# EAGLE design seniorprj1 (EAGLE 9.6.2)
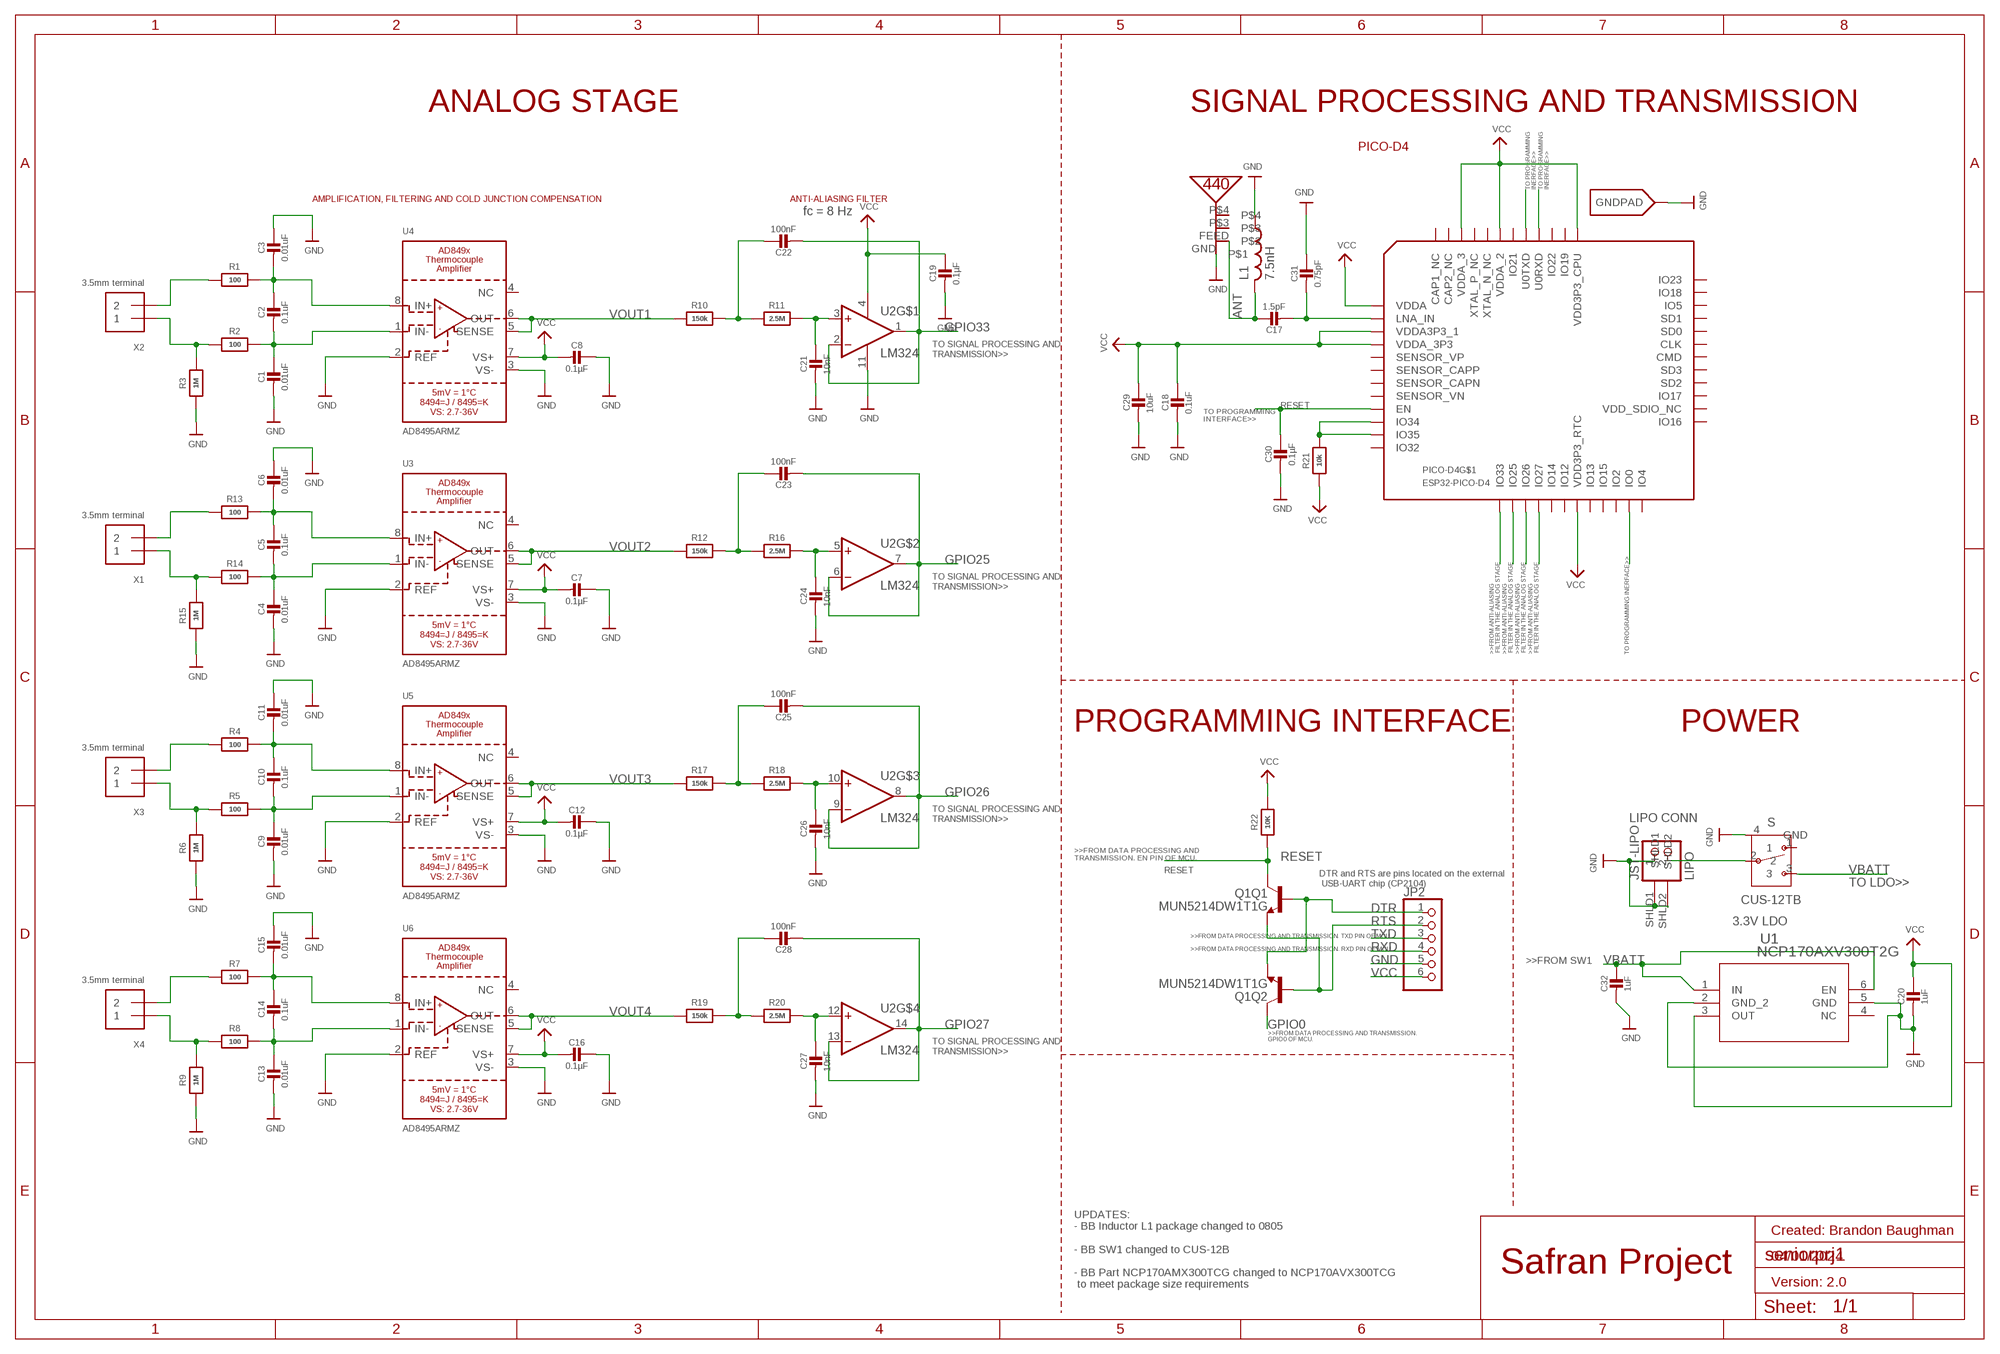
[diagram p0: schematic, sheet 1]

## Parts
C1  0.01uF  CAP_CERAMIC0805-NOOUTLINE  [0805-NO@1]
C2  0.1uF  CAP_CERAMIC0805-NOOUTLINE  [0805-NO@1]
C3  0.01uF  CAP_CERAMIC0805-NOOUTLINE  [0805-NO@1]
C4  0.01uF  CAP_CERAMIC0805-NOOUTLINE  [0805-NO@1]
C5  0.1uF  CAP_CERAMIC0805-NOOUTLINE  [0805-NO@1]
C6  0.01uF  CAP_CERAMIC0805-NOOUTLINE  [0805-NO@1]
C7  0.1µF  CAP_CERAMIC0805-NOOUTLINE  [0805-NO@1]
C8  0.1µF  CAP_CERAMIC0805-NOOUTLINE  [0805-NO@1]
C9  0.01uF  CAP_CERAMIC0805-NOOUTLINE  [0805-NO@1]
C10  0.1uF  CAP_CERAMIC0805-NOOUTLINE  [0805-NO@1]
C11  0.01uF  CAP_CERAMIC0805-NOOUTLINE  [0805-NO@1]
C12  0.1µF  CAP_CERAMIC0805-NOOUTLINE  [0805-NO@1]
C13  0.01uF  CAP_CERAMIC0805-NOOUTLINE  [0805-NO@1]
C14  0.1uF  CAP_CERAMIC0805-NOOUTLINE  [0805-NO@1]
C15  0.01uF  CAP_CERAMIC0805-NOOUTLINE  [0805-NO@1]
C16  0.1µF  CAP_CERAMIC0805-NOOUTLINE  [0805-NO@1]
C17  1.5pF  CAP_CERAMIC0805-NOOUTLINE  [0805-NO@1]
C18  0.1uF  CAP_CERAMIC0805-NOOUTLINE  [0805-NO@1]
C19  0.1µF  CAP_CERAMIC0805-NOOUTLINE  [0805-NO@1]
C20  1uF  CAP_CERAMIC0805-NOOUTLINE  [0805-NO@1]
C21  10nF  CAP_CERAMIC0805-NOOUTLINE  [0805-NO@1]
C22  100nF  CAP_CERAMIC0805-NOOUTLINE  [0805-NO@1]
C23  100nF  CAP_CERAMIC0805-NOOUTLINE  [0805-NO@1]
C24  10nF  CAP_CERAMIC0805-NOOUTLINE  [0805-NO@1]
C25  100nF  CAP_CERAMIC0805-NOOUTLINE  [0805-NO@1]
C26  10nF  CAP_CERAMIC0805-NOOUTLINE  [0805-NO@1]
C27  10nF  CAP_CERAMIC0805-NOOUTLINE  [0805-NO@1]
C28  100nF  CAP_CERAMIC0805-NOOUTLINE  [0805-NO@1]
C29  10uF  CAP_CERAMIC0805-NOOUTLINE  [0805-NO@1]
C30  0.1µF  CAP_CERAMIC0805-NOOUTLINE  [0805-NO@1]
C31  0.75pF  CAP_CERAMIC0805-NOOUTLINE  [0805-NO@1]
C32  1uF  CAP_CERAMIC0805-NOOUTLINE  [0805-NO@1]
JP2  PINHD-1X6  [1X06]
JST-LIPO  LIPO  JST_2PIN  [JSTPH2]
L1  7.5nH  INDUCTOR_0805_N  [RESC0805_N]
PICO-D4  ESP32-PICO-D4  [PICO-D4-QFN48]
Q1  MUN5214DW1T1G  MBT3904DW1T1  [DUAL_NPN_SC70-6]
R1  100  RESISTOR0805_NOOUTLINE  [0805-NO]
R2  100  RESISTOR0805_NOOUTLINE  [0805-NO]
R3  1M  RESISTOR0805_NOOUTLINE  [0805-NO]
R4  100  RESISTOR0805_NOOUTLINE  [0805-NO]
R5  100  RESISTOR0805_NOOUTLINE  [0805-NO]
R6  1M  RESISTOR0805_NOOUTLINE  [0805-NO]
R7  100  RESISTOR0805_NOOUTLINE  [0805-NO]
R8  100  RESISTOR0805_NOOUTLINE  [0805-NO]
R9  1M  RESISTOR0805_NOOUTLINE  [0805-NO]
R10  150k  RESISTOR0805_NOOUTLINE  [0805-NO]
R11  2.5M  RESISTOR0805_NOOUTLINE  [0805-NO]
R12  150k  RESISTOR0805_NOOUTLINE  [0805-NO]
R13  100  RESISTOR0805_NOOUTLINE  [0805-NO]
R14  100  RESISTOR0805_NOOUTLINE  [0805-NO]
R15  1M  RESISTOR0805_NOOUTLINE  [0805-NO]
R16  2.5M  RESISTOR0805_NOOUTLINE  [0805-NO]
R17  150k  RESISTOR0805_NOOUTLINE  [0805-NO]
R18  2.5M  RESISTOR0805_NOOUTLINE  [0805-NO]
R19  150k  RESISTOR0805_NOOUTLINE  [0805-NO]
R20  2.5M  RESISTOR0805_NOOUTLINE  [0805-NO]
R21  10k  RESISTOR0805_NOOUTLINE  [0805-NO]
R22  10K  RESISTOR0805_NOOUTLINE  [0805-NO]
S  CUS-12TB  [CUS-12B]
U1  NCP170AXV300T2G  [SOT-563_1P3X1P7_ONS]
U2  LM324  [SOIC127P600X175-14N]
U3  AD8495ARMZ  AD849X  [MSOP8_0.65MM]
U4  AD8495ARMZ  AD849X  [MSOP8_0.65MM]
U5  AD8495ARMZ  AD849X  [MSOP8_0.65MM]
U6  AD8495ARMZ  AD849X  [MSOP8_0.65MM]
U$35  PRO-OB-440  [PRO-OB-440]
X1  3.5mm terminal  TERMBLOCK_1X2  [TERMBLOCK_1X2-3.5MM]
X2  3.5mm terminal  TERMBLOCK_1X2  [TERMBLOCK_1X2-3.5MM]
X3  3.5mm terminal  TERMBLOCK_1X2  [TERMBLOCK_1X2-3.5MM]
X4  3.5mm terminal  TERMBLOCK_1X2  [TERMBLOCK_1X2-3.5MM]

## Nets
ANT: C17.1 L1.2 U$35.FEED
DTR: JP2.1 Q1.1(Q2:E) Q1.5(Q1:B)
GND: C1.2 C3.1 C4.2 C6.1 C7.1 C8.1 C9.2 C11.1 C12.1 C13.2 C15.1 C16.1 C18.2 C19.2 C20.2 C21.2 C24.2 C26.2 C27.2 C29.2 C30.2 C31.1 C32.2 JP2.5 JST-LIPO.1 JST-LIPO.SHLD1 JST-LIPO.SHLD2 L1.1 PICO-D4.EXP(GNDPAD) R3.1 R6.1 R9.1 R15.1 S.4(GND) U1.2(GND_2) U1.5(GND) U2.11(VCC-) U3.2(REF) U3.3(VS-) U4.2(REF) U4.3(VS-) U5.2(REF) U5.3(VS-) U6.2(REF) U6.3(VS-) U$35.GND
GPIO0: PICO-D4.23(IO0) Q1.6(Q2:C)
GPIO25: C23.2 U2.6(INVERTING_INPUT2) U2.7(OUTPUT2)
GPIO26: C25.2 U2.8(OUTPUT3) U2.9(INVERTING_INPUT3)
GPIO27: C28.2 U2.13(INVERTING_INPUT4) U2.14(OUTPUT4)
GPIO33: C22.2 U2.1(OUTPUT1) U2.2(INVERTING_INPUT1)
IN+: R13.1 X1.2
IN+1: R1.1 X2.2
IN+2: R4.1 X3.2
IN+3: R7.1 X4.2
IN-: R14.1 R15.2 X1.1
IN-1: R2.1 R3.2 X2.1
IN-2: R5.1 R6.2 X3.1
IN-3: R8.1 R9.2 X4.1
LNA_IN: C17.2 C31.2 PICO-D4.2(LNA_IN)
N$1: C2.1 C3.2 R1.2 U4.8(IN+)
N$2: C5.1 C6.2 R13.2 U3.8(IN+)
N$3: C4.1 C5.2 R14.2
N$4: U3.1(IN-)
N$5: C1.1 C2.2 R2.2 U4.1(IN-)
N$7: C10.1 C11.2 R4.2 U5.8(IN+)
N$8: C9.1 C10.2 R5.2
N$9: U5.1(IN-)
N$10: C14.1 C15.2 R7.2 U6.8(IN+)
N$11: C13.1 C14.2 R8.2
N$12: U6.1(IN-)
N$13: JST-LIPO.2 S.2
N$14: C22.1 R10.2 R11.1
N$15: PICO-D4.13(IO33)
N$16: C21.1 R11.2 U2.3(NON-INVERTING_INPUT1)
N$17: C24.1 R16.2 U2.5(NON-INVERTING_INPUT2)
N$18: C23.1 R12.2 R16.1
N$19: PICO-D4.14(IO25)
N$20: C25.1 R17.2 R18.1
N$21: C28.1 R19.2 R20.1
N$22: C26.1 R18.2 U2.10(NON-INVERTING_INPUT3)
N$23: C27.1 R20.2 U2.12(NON-INVERTING_INPUT4)
N$24: PICO-D4.15(IO26)
N$25: PICO-D4.16(IO27)
N$26: PICO-D4.10(IO34) PICO-D4.11(IO35) R21.2
RESET: C30.1 PICO-D4.9(EN) Q1.3(Q1:C) R22.1
RTS: JP2.2 Q1.2(Q2:B) Q1.4(Q1:E)
RXD: JP2.4 PICO-D4.40(U0RXD)
TXD: JP2.3 PICO-D4.41(U0TXD)
VBATT: C32.1 S.3 U1.1(IN) U1.6(EN)
VCC: C7.2 C8.2 C12.2 C16.2 C18.1 C19.1 C20.1 C29.1 JP2.6 PICO-D4.1(VDDA) PICO-D4.3(VDDA3P3_1) PICO-D4.4(VDDA_3P3) PICO-D4.19(VDD3P3_RTC) PICO-D4.37(VDD3P3_CPU) PICO-D4.43(VDDA_2) PICO-D4.46(VDDA_3) R21.1 R22.2 U1.3(OUT) U2.4(VCC+) U3.7(VS+) U4.7(VS+) U5.7(VS+) U6.7(VS+)
VOUT1: R10.1 U4.5(SENSE) U4.6(OUT)
VOUT2: R12.1 U3.5(SENSE) U3.6(OUT)
VOUT3: R17.1 U5.5(SENSE) U5.6(OUT)
VOUT4: R19.1 U6.5(SENSE) U6.6(OUT)
Unconnected: PICO-D4.5(SENSOR_VP) PICO-D4.6(SENSOR_CAPP) PICO-D4.8(SENSOR_VN) PICO-D4.12(IO32) PICO-D4.17(IO14) PICO-D4.20(IO13) PICO-D4.21(IO15) PICO-D4.22(IO2) PICO-D4.24(IO4) PICO-D4.25(IO16) PICO-D4.26(VDD_SDIO_NC) PICO-D4.27(IO17) PICO-D4.28(SD2) PICO-D4.29(SD3) PICO-D4.30(CMD) PICO-D4.31(CLK) PICO-D4.32(SD0) PICO-D4.33(SD1) PICO-D4.34(IO5) PICO-D4.35(IO18) PICO-D4.36(IO23) PICO-D4.38(IO19) PICO-D4.39(IO22) PICO-D4.44(XTAL_N_NC) PICO-D4.45(XTAL_P_NC) PICO-D4.47(CAP2_NC) PICO-D4.48(CAP1_NC) S.1 U1.4(NC) U3.4(NC) U4.4(NC) U5.4(NC) U6.4(NC) U$35.P$3 U$35.P$4

## Notes on the sheet
- ANALOG STAGE | SIGNAL PROCESSING AND TRANSMISSION
- PICO-D4
- TO PROGRAMMING
  INERFACE>>
- TO PROGRAMMING
  INERFACE>>
- AMPLIFICATION, FILTERING AND COLD JUNCTION COMPENSATION | ANTI-ALIASING FILTER
- fc = 8 Hz
- TO SIGNAL PROCESSING AND 
  TRANSMISSION>>
- TO PROGRAMMING 
  INTERFACE>>
- TO SIGNAL PROCESSING AND 
  TRANSMISSION>>
- >>FROM ANTI-ALIASING
   FILTER IN THE ANALOG STAGE
- >>FROM ANTI-ALIASING
   FILTER IN THE ANALOG STAGE
- >>FROM ANTI-ALIASING
   FILTER IN THE ANALOG STAGE
- >>FROM ANTI-ALIASING
   FILTER IN THE ANALOG STAGE
- TO PROGRAMMING INERFACE>>
- PROGRAMMING INTERFACE | POWER
- TO SIGNAL PROCESSING AND 
  TRANSMISSION>>
- LIPO CONN
- >>FROM DATA PROCESSING AND
  TRANSMISSION. EN PIN OF MCU.
- DTR and RTS are pins located on the external
   USB-UART chip (CP2104)
- TO LDO>>
- 3.3V LDO
- >>FROM DATA PROCESSING AND TRANSMISSION. TXD PIN OF MCU.
- >>FROM DATA PROCESSING AND TRANSMISSION. RXD PIN OF MCU.
- >>FROM SW1
- >>FROM DATA PROCESSING AND TRANSMISSION. 
  GPIO0 OF MCU.
- TO SIGNAL PROCESSING AND 
  TRANSMISSION>>
- NCP167BMX330TBG
- NCP167BMX330TBG
- Created: Brandon Baughman
- 04/01/2024
- Safran Project
- Version: 2.0
- UPDATES:
  - BB Inductor L1 package changed to 0805
  
  - BB SW1 changed to CUS-12B
  
  - BB Part NCP170AMX300TCG changed to NCP170AVX300TCG
   to meet package size requirements

## Power pins joined to a net without a drawn wire
IO12: PICO-D4.18(IO12)
IO21: PICO-D4.42(IO21)
SENSOR_CAPN: PICO-D4.7(SENSOR_CAPN)

## Library data of the parts
C1 C3 C4 C6 C9 C11 C13 C15 = microbuilder:CAP_CERAMIC: Ceramic Capacitors For new designs, use the packages preceded by an '_' character since they are more reliable: The following footprints should be used on most boards: _0402 - Standard footprint for regular board layouts _0603 - Standard footprint for regular board layouts _0805 - Standard footprint for regular board layouts _1206 - Standard footprint for regular board layouts For extremely tight-pitch boards where space is at a premium, the following 'micro-pitch' footprints can be used (smaller pads, no silkscreen outline, etc.): _0402MP - Micro-pitch footprint for very dense/compact boards _0603MP - Micro-pitch footprint for very dense/compact boards _0805MP - Micro-pitch footprint for very dense/compact boards _1206MP - Micro-pitch footprint for very dense/compact boards; MF: KEMET; MPN: R76PD2100SE30J; OC_NEWARK: 58Y5376
C2 C5 C7 C8 C10 C12 C14 C16 C18 C19 C22 C23 C25 C28 C30 = microbuilder:CAP_CERAMIC: Ceramic Capacitors For new designs, use the packages preceded by an '_' character since they are more reliable: The following footprints should be used on most boards: _0402 - Standard footprint for regular board layouts _0603 - Standard footprint for regular board layouts _0805 - Standard footprint for regular board layouts _1206 - Standard footprint for regular board layouts For extremely tight-pitch boards where space is at a premium, the following 'micro-pitch' footprints can be used (smaller pads, no silkscreen outline, etc.): _0402MP - Micro-pitch footprint for very dense/compact boards _0603MP - Micro-pitch footprint for very dense/compact boards _0805MP - Micro-pitch footprint for very dense/compact boards _1206MP - Micro-pitch footprint for very dense/compact boards; MF: KEMET; MPN: C0805C104K1RECTU; OC_NEWARK: 02AH1357
C17 = microbuilder:CAP_CERAMIC: Ceramic Capacitors For new designs, use the packages preceded by an '_' character since they are more reliable: The following footprints should be used on most boards: _0402 - Standard footprint for regular board layouts _0603 - Standard footprint for regular board layouts _0805 - Standard footprint for regular board layouts _1206 - Standard footprint for regular board layouts For extremely tight-pitch boards where space is at a premium, the following 'micro-pitch' footprints can be used (smaller pads, no silkscreen outline, etc.): _0402MP - Micro-pitch footprint for very dense/compact boards _0603MP - Micro-pitch footprint for very dense/compact boards _0805MP - Micro-pitch footprint for very dense/compact boards _1206MP - Micro-pitch footprint for very dense/compact boards; MF: YAGEO; MPN: CC0805CRNPO9BN1R5; OC_NEWARK: 26AK1928
C20 C32 = microbuilder:CAP_CERAMIC: Ceramic Capacitors For new designs, use the packages preceded by an '_' character since they are more reliable: The following footprints should be used on most boards: _0402 - Standard footprint for regular board layouts _0603 - Standard footprint for regular board layouts _0805 - Standard footprint for regular board layouts _1206 - Standard footprint for regular board layouts For extremely tight-pitch boards where space is at a premium, the following 'micro-pitch' footprints can be used (smaller pads, no silkscreen outline, etc.): _0402MP - Micro-pitch footprint for very dense/compact boards _0603MP - Micro-pitch footprint for very dense/compact boards _0805MP - Micro-pitch footprint for very dense/compact boards _1206MP - Micro-pitch footprint for very dense/compact boards; MF: KYOCERA AVX; MPN: 08051C105K4T2A; OC_NEWARK: 47AC9927
C21 C24 C26 C27 = microbuilder:CAP_CERAMIC: Ceramic Capacitors For new designs, use the packages preceded by an '_' character since they are more reliable: The following footprints should be used on most boards: _0402 - Standard footprint for regular board layouts _0603 - Standard footprint for regular board layouts _0805 - Standard footprint for regular board layouts _1206 - Standard footprint for regular board layouts For extremely tight-pitch boards where space is at a premium, the following 'micro-pitch' footprints can be used (smaller pads, no silkscreen outline, etc.): _0402MP - Micro-pitch footprint for very dense/compact boards _0603MP - Micro-pitch footprint for very dense/compact boards _0805MP - Micro-pitch footprint for very dense/compact boards _1206MP - Micro-pitch footprint for very dense/compact boards; MF: KEMET; MPN: C0805C103K1RECTU; OC_NEWARK: 02AH1349
C29 = microbuilder:CAP_CERAMIC: Ceramic Capacitors For new designs, use the packages preceded by an '_' character since they are more reliable: The following footprints should be used on most boards: _0402 - Standard footprint for regular board layouts _0603 - Standard footprint for regular board layouts _0805 - Standard footprint for regular board layouts _1206 - Standard footprint for regular board layouts For extremely tight-pitch boards where space is at a premium, the following 'micro-pitch' footprints can be used (smaller pads, no silkscreen outline, etc.): _0402MP - Micro-pitch footprint for very dense/compact boards _0603MP - Micro-pitch footprint for very dense/compact boards _0805MP - Micro-pitch footprint for very dense/compact boards _1206MP - Micro-pitch footprint for very dense/compact boards; MF: KEMET; MPN: C0805C106J8RACAUTO; OC_NEWARK: 33AC0556
C31 = microbuilder:CAP_CERAMIC: Ceramic Capacitors For new designs, use the packages preceded by an '_' character since they are more reliable: The following footprints should be used on most boards: _0402 - Standard footprint for regular board layouts _0603 - Standard footprint for regular board layouts _0805 - Standard footprint for regular board layouts _1206 - Standard footprint for regular board layouts For extremely tight-pitch boards where space is at a premium, the following 'micro-pitch' footprints can be used (smaller pads, no silkscreen outline, etc.): _0402MP - Micro-pitch footprint for very dense/compact boards _0603MP - Micro-pitch footprint for very dense/compact boards _0805MP - Micro-pitch footprint for very dense/compact boards _1206MP - Micro-pitch footprint for very dense/compact boards; OC_NEWARK: unknown
JP2 = adafruit:PINHD-1X6: PIN HEADER; MF: AMP - TE CONNECTIVITY; MPN: 826631-6; OC_NEWARK: 36AC9024
JST-LIPO = UnexpectedMaker:JST_2PIN: JST 2-Pin Right-Angle Connector PH-Series - 4UConnector: 17311 SH-Series - 4UConnector: 07278; OC_NEWARK: unknown
L1 = Nordic_nRF:INDUCTOR: Generic chip inductor; MF: PULSE ELECTRONICS; MPN: BSPQ000603047N5H00; OC_NEWARK: 52AK8581
PICO-D4 = UnexpectedMaker:ESP32-PICO-D4; OC_NEWARK: unknown
Q1 = UnexpectedMaker:MBT3904DW1T1: MBT3904DW1 Dual NPN Transistors The MBT3904W1 puts two general purpose 3904 NPN transistors in a single package. Datasheet <http://www.onsemi.com/pub_link/Collateral/MBT3904DW1T1-D.PDF>; MF: ONSEMI; MPN: MUN5214DW1T1G; OC_NEWARK: 80Y9477; PROD_ID: TRANS-13337
R1 R2 R4 R5 R7 R8 R13 R14 = microbuilder:RESISTOR: Resistors For new designs, use the packages preceded by an '_' character since they are more reliable: The following footprints should be used on most boards: _0402 - Standard footprint for regular board layouts _0603 - Standard footprint for regular board layouts _0805 - Standard footprint for regular board layouts _1206 - Standard footprint for regular board layouts For extremely tight-pitch boards where space is at a premium, the following 'micro-pitch' footprints can be used (smaller pads, no silkscreen outline, etc.): _0402MP - Micro-pitch footprint for very dense/compact boards _0603MP - Micro-pitch footprint for very dense/compact boards _0805MP - Micro-pitch footprint for very dense/compact boards _1206MP - Micro-pitch footprint for very dense/compact boards; MF: VISHAY; MPN: CRCW0805100RFKTA; OC_NEWARK: 05F1505
R3 R6 R9 R15 = microbuilder:RESISTOR: Resistors For new designs, use the packages preceded by an '_' character since they are more reliable: The following footprints should be used on most boards: _0402 - Standard footprint for regular board layouts _0603 - Standard footprint for regular board layouts _0805 - Standard footprint for regular board layouts _1206 - Standard footprint for regular board layouts For extremely tight-pitch boards where space is at a premium, the following 'micro-pitch' footprints can be used (smaller pads, no silkscreen outline, etc.): _0402MP - Micro-pitch footprint for very dense/compact boards _0603MP - Micro-pitch footprint for very dense/compact boards _0805MP - Micro-pitch footprint for very dense/compact boards _1206MP - Micro-pitch footprint for very dense/compact boards; MF: PANASONIC; MPN: ERJ-P06J105V; OC_NEWARK: 81AC8346
R10 R12 R17 R19 = microbuilder:RESISTOR: Resistors For new designs, use the packages preceded by an '_' character since they are more reliable: The following footprints should be used on most boards: _0402 - Standard footprint for regular board layouts _0603 - Standard footprint for regular board layouts _0805 - Standard footprint for regular board layouts _1206 - Standard footprint for regular board layouts For extremely tight-pitch boards where space is at a premium, the following 'micro-pitch' footprints can be used (smaller pads, no silkscreen outline, etc.): _0402MP - Micro-pitch footprint for very dense/compact boards _0603MP - Micro-pitch footprint for very dense/compact boards _0805MP - Micro-pitch footprint for very dense/compact boards _1206MP - Micro-pitch footprint for very dense/compact boards; MF: VISHAY; MPN: CRCW0805150KFKEA; OC_NEWARK: 52K9891
R11 R16 R18 R20 = microbuilder:RESISTOR: Resistors For new designs, use the packages preceded by an '_' character since they are more reliable: The following footprints should be used on most boards: _0402 - Standard footprint for regular board layouts _0603 - Standard footprint for regular board layouts _0805 - Standard footprint for regular board layouts _1206 - Standard footprint for regular board layouts For extremely tight-pitch boards where space is at a premium, the following 'micro-pitch' footprints can be used (smaller pads, no silkscreen outline, etc.): _0402MP - Micro-pitch footprint for very dense/compact boards _0603MP - Micro-pitch footprint for very dense/compact boards _0805MP - Micro-pitch footprint for very dense/compact boards _1206MP - Micro-pitch footprint for very dense/compact boards; OC_NEWARK: unknown
R21 R22 = microbuilder:RESISTOR: Resistors For new designs, use the packages preceded by an '_' character since they are more reliable: The following footprints should be used on most boards: _0402 - Standard footprint for regular board layouts _0603 - Standard footprint for regular board layouts _0805 - Standard footprint for regular board layouts _1206 - Standard footprint for regular board layouts For extremely tight-pitch boards where space is at a premium, the following 'micro-pitch' footprints can be used (smaller pads, no silkscreen outline, etc.): _0402MP - Micro-pitch footprint for very dense/compact boards _0603MP - Micro-pitch footprint for very dense/compact boards _0805MP - Micro-pitch footprint for very dense/compact boards _1206MP - Micro-pitch footprint for very dense/compact boards; MF: YAGEO; MPN: RC0805FR-0710KL; OC_NEWARK: 05M4535
S = CUS-12TB:CUS-12TB: LOW-PROFILE SLIDE SWITCHES Source: Datasheet <http://www.nidec-copal-electronics.com/e/catalog/switch/cus.pdf> Check availability <https://pricing.snapeda.com/parts/CUS-12TB/Nidec%20Components/view-part?ref=eda>; AVAILABILITY: In Stock; CHECK_PRICES: https://www.snapeda.com/parts/CUS-12TB/NIC+Components/view-part/?ref=eda; DESCRIPTION: Slide Switch, SPDT, 300mA, 4V, Standard, Surface Mount, Right Angle, CUS Serie | Nidec Components CUS-12TB; MF: Nidec Components; MP: CUS-12TB; PACKAGE: None; PRICE: None; SNAPEDA_LINK: https://www.snapeda.com/parts/CUS-12TB/NIC+Components/view-part/?ref=snap
U1 = ncp:NCP170AXV300T2G; COPYRIGHT: Copyright (C) 2024 Ultra Librarian. All rights reserved.; MANUFACTURER_PART_NUMBER: NCP170AXV300T2G; MFR_NAME: onsemi
U2 = LM324:LM324: these devices consist of four independent high-gain frequency-compensated operational amplifiers that are designed sp...; AVAILABILITY: Unavailable; DESCRIPTION: these devices consist of four independent high-gain frequency-compensated operational amplifiers that are designed sp...; MF: Texas Instruments; MP: LM324; MPN: LM324N/NOPB; OC_NEWARK: 34AH0947; PACKAGE: SOIC-14 Texas Instruments; PRICE: None
U3-U6 = microbuilder:AD849X: AD8494/8495 - Precision Thermocouple Amplifier with Cold Junction Compensation For J-Type Thermocouples use AD8494, For K-Type use AD8495 5 mV/°C thermometer output Single Supply: 2.7 V to 36 V Dual Supply: ±2.7 V to ±18 V; MF: ANALOG DEVICES; MPN: AD8495ARMZ-R7; OC_NEWARK: 60AK7538
U$35 = UnexpectedMaker:PRO-OB-440; OC_NEWARK: unknown
X1-X4 = microbuilder:TERMBLOCK_1X2: 3.5mm Terminal block http://www.ladyada.net/library/pcb/eaglelibrary.html; MF: MULTICOMP PRO; MPN: MA212-350M02; OC_NEWARK: 04R6808

## Module TEST
Ports: 

### Library data of the parts

## Board
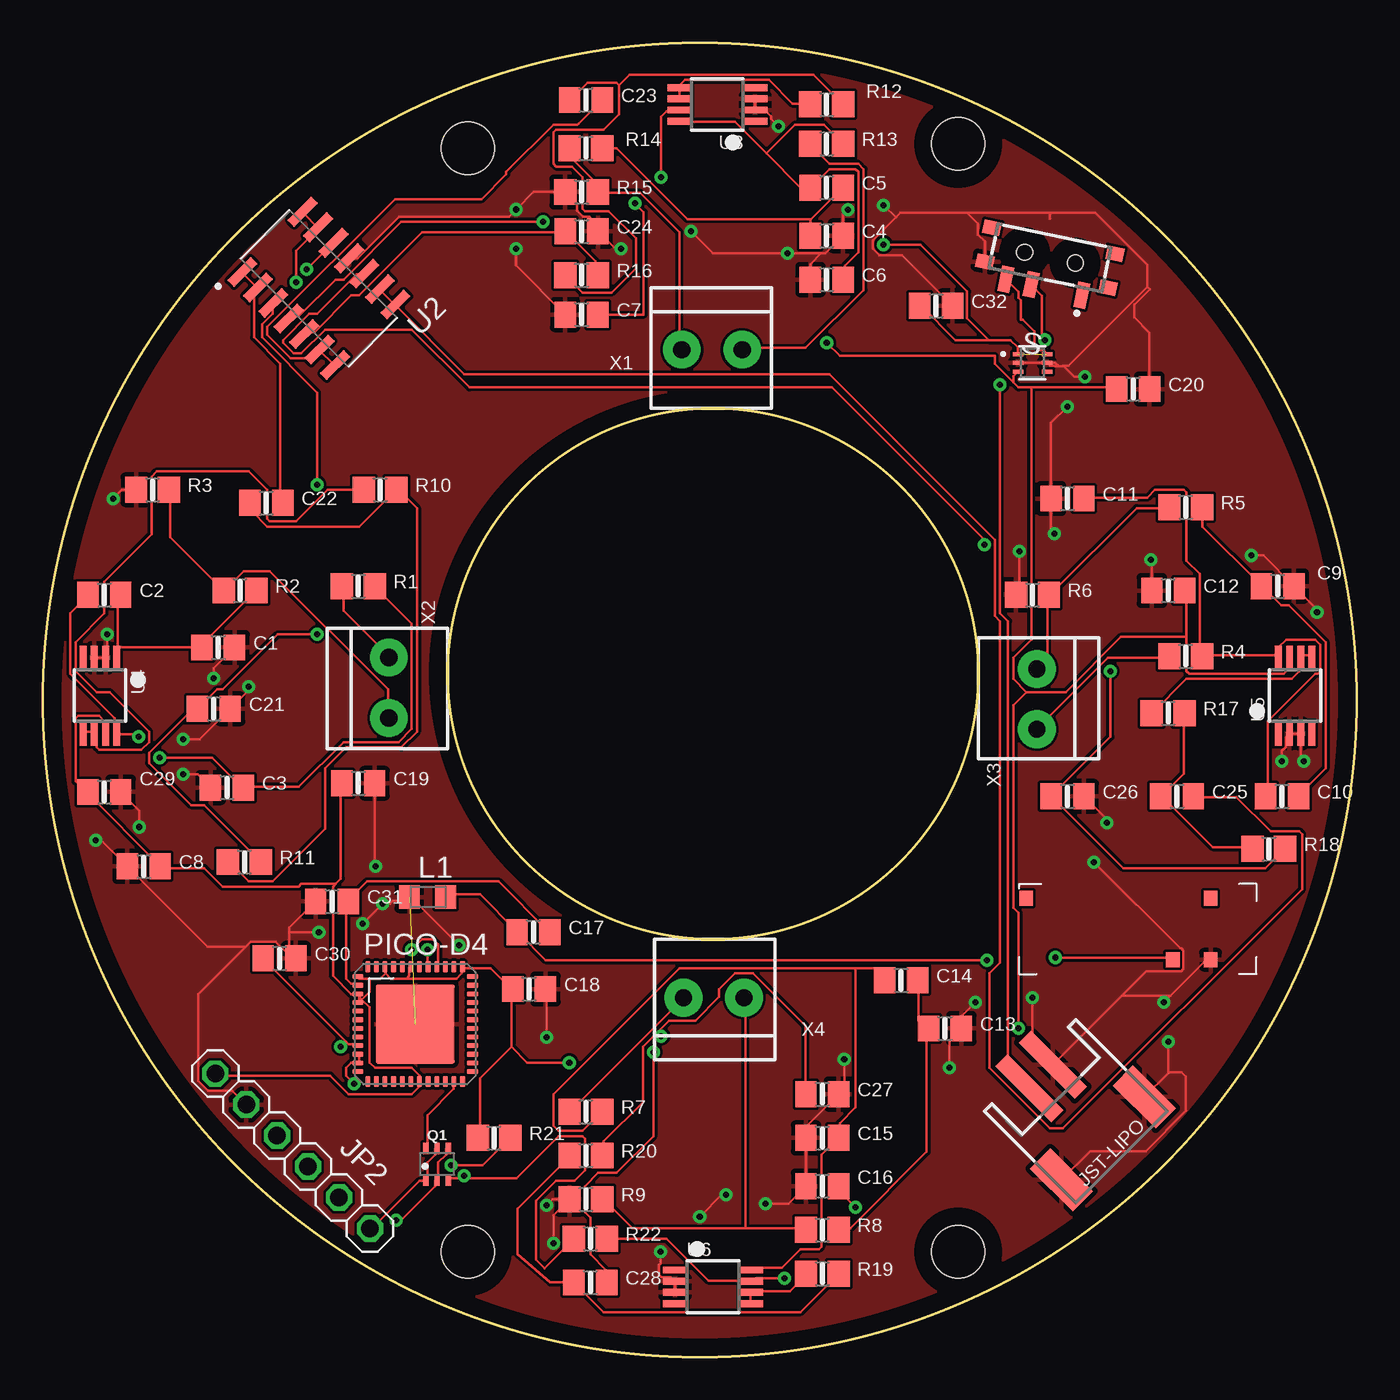
[diagram p1: board, top side]
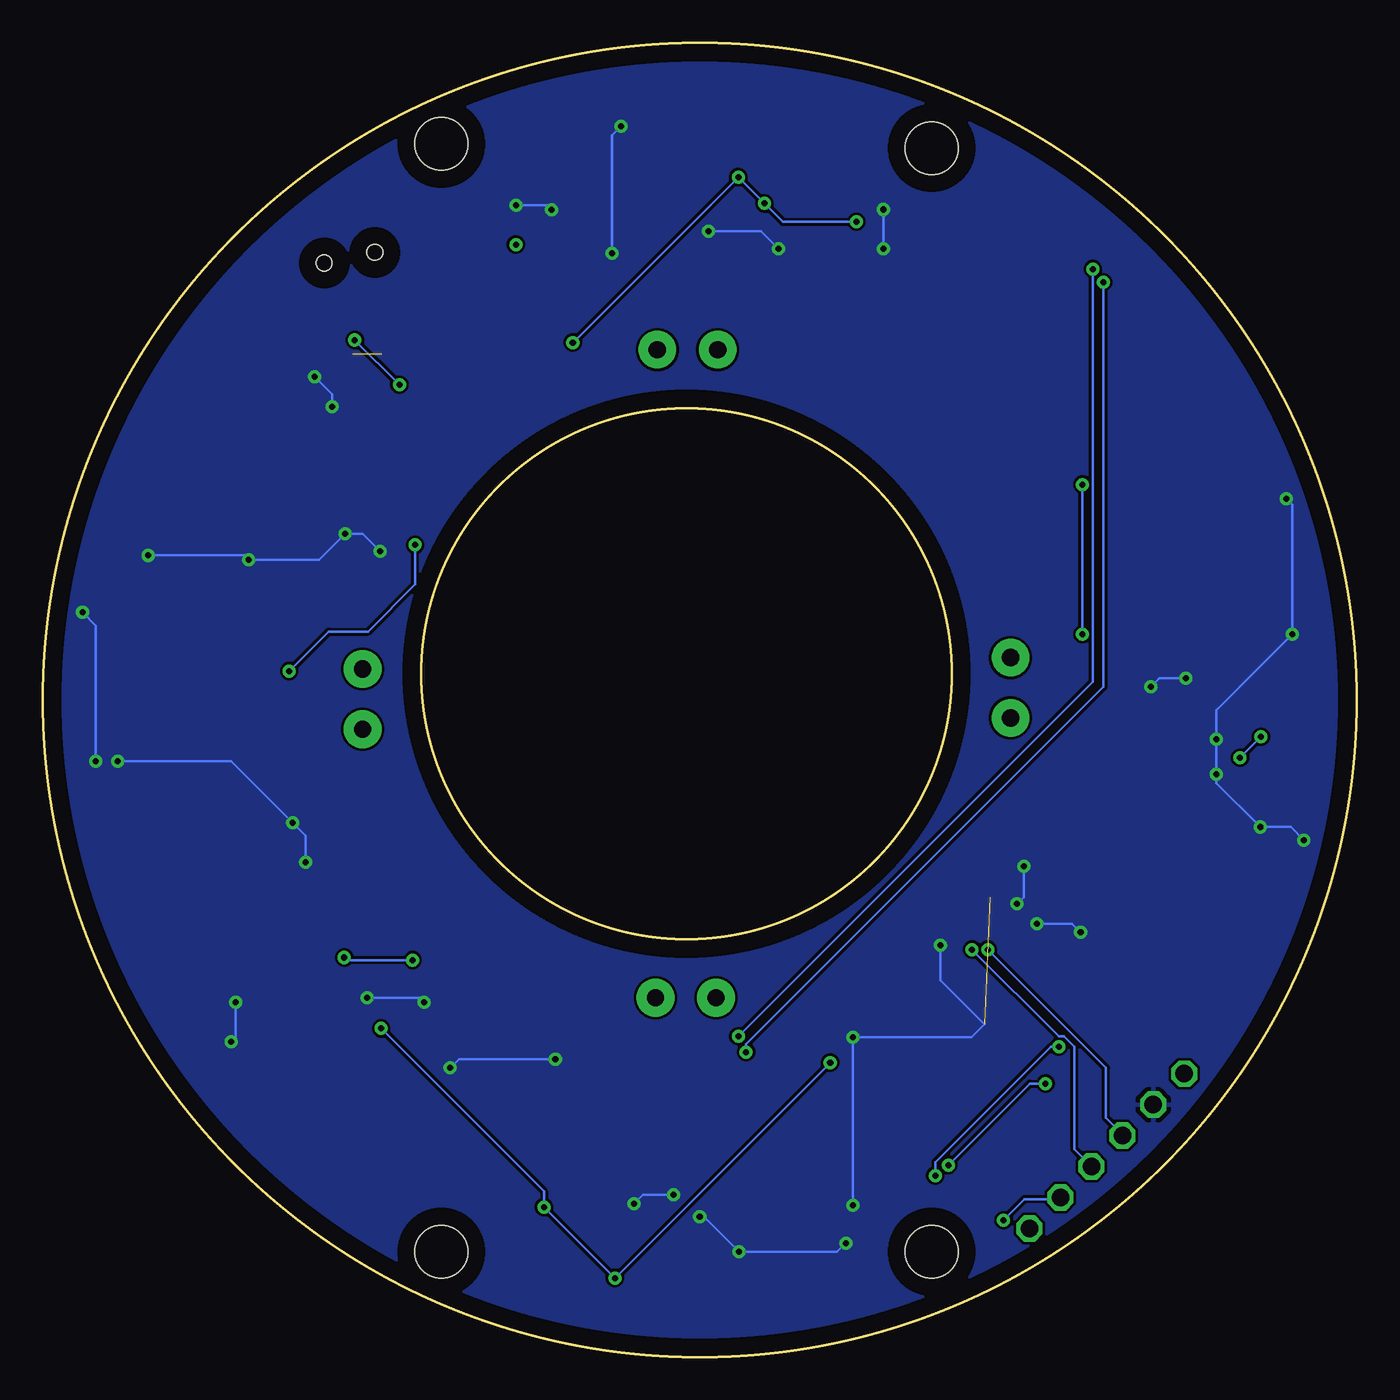
[diagram p2: board, bottom side, seen from below]

Size 76.2 x 76.2 mm. Coordinates in mm from the lower left corner, seen from the top.
Outline: circle at 38.1,38.1 radius 38.1
Outline: circle at 38.86,39.62 radius 15.38
Copper layers (1*16): Top 0.035mm / dielectric 1.5mm / Bottom 0.035mm
Design rules "default": minimum track width 6mil, minimum drill 0.35mm, track to track 6mil, track to pad 6mil, pad to pad 6mil, via to via 6mil, smd to smd 6mil, copper to edge 40mil, drill to drill 6mil, minimum pad ring 10mil, minimum via ring 8mil, stop-mask expansion 4mil, vias tented up to drill 0mil, thermal gap 10mil
Holes 3.05 mm at 53.09,6.1 24.64,6.1 24.64,70.1 53.09,70.36

### Footprints (pad centres in the part's own frame; a part is rotated, then mirrored left to right if it is on the bottom)
0805-NO@1 = smd 1.24 x 1.5: 1 -0.95,0; 2 0.95,0
1X06 = drill 1.016 octagon: 1 -6.35,0; 2 -3.81,0; 3 -1.27,0; 4 1.27,0; 5 3.81,0; 6 6.35,0
JSTPH2 = smd 1 x 4.6: 1 -0.965,-3.607; 2 0.965,-3.607 | smd 1.651 x 3.505: SHLD1 -3.4,1.473; SHLD2 3.4,1.473
RESC0805_N = smd 1.2 x 1.35: 1 -1.1,0; 2 1,0
PICO-D4-QFN48 = smd 0.66 x 0.3: 1 -3.327,2.75; 2 -3.327,2.25; 3 -3.327,1.75; 4 -3.327,1.25; 5 -3.327,0.75; 6 -3.327,0.25; 7 -3.327,-0.25; 8 -3.327,-0.75; 9 -3.327,-1.25; 10 -3.327,-1.75; 11 -3.327,-2.25; 12 -3.327,-2.75; 25 3.327,-2.75; 26 3.327,-2.25; 27 3.327,-1.75; 28 3.327,-1.25; 29 3.327,-0.75; 30 3.327,-0.25; 31 3.327,0.25; 32 3.327,0.75; 33 3.327,1.25; 34 3.327,1.75; 35 3.327,2.25; 36 3.327,2.75 | smd 0.3 x 0.66: 13 -2.75,-3.327; 14 -2.25,-3.327; 15 -1.75,-3.327; 16 -1.25,-3.327; 17 -0.75,-3.327; 18 -0.25,-3.327; 19 0.25,-3.327; 20 0.75,-3.327; 21 1.25,-3.327; 22 1.75,-3.327; 23 2.25,-3.327; 24 2.75,-3.327; 37 2.75,3.327; 38 2.25,3.327; 39 1.75,3.327; 40 1.25,3.327; 41 0.75,3.327; 42 0.25,3.327; 43 -0.25,3.327; 44 -0.75,3.327; 45 -1.25,3.327; 46 -1.75,3.327; 47 -2.25,3.327; 48 -2.75,3.327 | smd 4.572 x 4.572: EXP 0,0
DUAL_NPN_SC70-6 = smd 0.3 x 0.66: 1 -0.65,-0.92; 2 0,-0.92; 3 0.65,-0.92; 4 0.65,0.92; 5 0,0.92; 6 -0.65,0.92
0805-NO = smd 1.3 x 1.5: 1 -0.95,0; 2 0.95,0
CUS-12B = smd 0.7 x 1.5: 1 -2.25,1.75; 2 0.75,1.75; 3 2.25,1.75 | smd 1 x 0.8: 4 3.65,1; 5 3.65,-1; 6 -3.65,-1; 7 -3.65,1 | hole 0.9: -1.5,0; 1.5,0
SOT-563_1P3X1P7_ONS = smd 0.61 x 0.229: 1 -0.838,0.508; 2 -0.838,0; 3 -0.838,-0.508; 4 0.838,-0.508; 5 0.838,0; 6 0.838,0.508
SOIC127P600X175-14N = smd 1.97 x 0.6: 1 -2.475,3.81; 2 -2.475,2.54; 3 -2.475,1.27; 4 -2.475,0; 5 -2.475,-1.27; 6 -2.475,-2.54; 7 -2.475,-3.81; 8 2.475,-3.81; 9 2.475,-2.54; 10 2.475,-1.27; 11 2.475,0; 12 2.475,1.27; 13 2.475,2.54; 14 2.475,3.81
MSOP8_0.65MM = smd 0.4 x 1.4: 1 -0.975,-2.2; 2 -0.325,-2.2; 3 0.325,-2.2; 4 0.975,-2.2; 5 0.975,2.2; 6 0.325,2.2; 7 -0.325,2.2; 8 -0.975,2.2
PRO-OB-440 = smd 0.8 x 0.86: FEED 8.9,-4.4; GND 11.1,-4.4; P$3 11.1,-0.83; P$4 0.4,-0.83
TERMBLOCK_1X2-3.5MM = drill 1 pad 2.184: 1 1.8,0; 2 -1.7,0

### Placement (x,y rotation side)
C1  10.16,41.15 0 top
C2  3.56,44.2 0 top
C3  10.67,33.02 0 top
C4  45.47,65.02 0 top
C5  45.47,67.82 0 top
C6  45.47,62.48 0 top
C7  31.24,60.45 0 top
C8  5.84,28.45 0 top
C9  71.63,44.7 0 top
C10  71.88,32.51 0 top
C11  59.44,49.78 0 top
C12  65.28,44.45 0 top
C13  52.32,19.05 0 top
C14  49.78,21.84 0 top
C15  45.21,12.7 0 top
C16  45.21,9.91 0 top
C17  28.45,24.64 0 top
C18  28.19,21.34 0 top
C19  18.29,33.27 0 top
C20  63.25,56.13 0 top
C21  9.91,37.59 0 top
C22  12.95,49.53 0 top
C23  31.5,72.9 0 top
C24  31.24,65.28 0 top
C25  65.79,32.51 0 top
C26  59.44,32.51 0 top
C27  45.21,15.24 0 top
C28  31.75,4.32 0 top
C29  3.56,32.77 0 top
C30  13.72,23.11 0 top
C31  16.76,26.42 0 top
C32  51.82,60.96 0 top
JP2  14.48,11.94 135 top
JST-LIPO  60.45,13.72 225 top
L1  22.35,26.67 0 top
PICO-D4  21.59,19.3 0 top
Q1  22.86,11.18 0 top
R1  18.29,44.7 0 top
R2  11.43,44.45 0 top
R3  6.35,50.29 0 top
R4  66.29,40.64 0 top
R5  66.29,49.28 0 top
R6  57.4,44.2 0 top
R7  31.5,14.22 0 top
R8  45.21,7.37 0 top
R9  31.5,9.14 0 top
R10  19.56,50.29 0 top
R11  11.68,28.7 0 top
R12  45.47,72.64 0 top
R13  45.47,70.36 0 top
R14  31.5,70.1 0 top
R15  31.24,67.56 0 top
R16  31.24,62.74 0 top
R17  65.28,37.34 0 top
R18  71.12,29.46 0 top
R19  45.21,4.83 0 top
R20  31.5,11.68 0 top
R21  26.16,12.7 0 top
R22  31.75,6.86 0 top
S  58.42,63.75 168.1 top
U1  57.4,57.66 0 top
U2  16,61.98 45 top
U3  39.12,72.64 90 top
U4  3.3,38.35 180 top
U5  72.64,38.35 0 top
U6  38.86,4.06 270 top
U$35  56.64,27.43 0 top
X1  38.86,58.42 180 top
X2  20.07,38.86 270 top
X3  57.66,38.1 90 top
X4  38.86,20.83 0 top

### Tracks (layer width: path | path; a pad name or v marks a point on that pad's centre or on a via)
ANT  (via drill 0.35)
  Top 0.152: L1.2 22.84,26.82 25.35,26.82 27.48,24.69 C17.1 27.64,24.54 29.16,23.01 v54.76,23.01 | v58.73,23.17 65.43,23.17 U$35.FEED
  Bottom 0.152: v58.73,23.17 58.57,23.01 v54.76,23.01
DTR
  Top 0.152: Q1.5 22.76,12.04 22.76,11.74 22.3,11.28 22.3,10.36 Q1.1 22.15,10.21 21.84,10.21 19.1,7.47 JP2.1
GND  (via drill 0.35)  (1 unrouted)
  Top 0.152: U5.2 72.44,36.12 72.44,36.13 | 64.07,62.05 64.07,63.33 61.05,66.36 58.42,66.36 | C32.2 49.82,63.91 48.52,63.91 48.16,64.27 48.16,64.77 49.48,66.09 | 64.07,62.05 59.5,57.48 59.18,57.48 59.22,57.44 | 58.42,66.36 53.59,66.36 | 53.59,66.36 49.75,66.36 49.48,66.09 | C29.2 5.59,31.68 v5.59,30.73 | v3.05,29.97 3.37,29.97 C8.1 9.54,23.8 11.76,23.8 | 64.07,62.05 64.21,61.92 | 64.21,61.92 | 64.21,61.92 63.31,61.02 63.31,60.29 64.2,59.4 C20.2 | v59.44,55.12 58.49,54.17 C11.1 58.49,47.94 v58.67,47.75 | v60.45,56.84 59.82,56.84 59.22,57.44 | U$35.GND 67.48,23.03 65.41,20.96 | 65.41,20.96 v65.02,20.57 | v65.28,18.29 65.28,16.51 | 65.28,16.51 65.28,16.46 JST-LIPO.SHLD1 | v46.48,17.27 46.48,15.56 C27.2 44.26,13.34 C15.1 C16.1 43.25,8.89 v41.91,8.89 | v52.58,16.76 52.58,18.35 C13.2 53.27,19.75 v54.1,20.57 | U6.3 U6.2 36.44,4.61 35.87,4.61 35.73,4.74 35.73,5.33 35.81,5.41 v35.81,6.1 | v38.1,8.13 39.37,9.4 v39.62,9.4 | v29.62,6.6 29.62,8.22 R9.1 29.56,9.14 v29.21,8.79 | v29.21,18.54 29.21,21.27 C18.2 | L1.1 21.8,26.2 | v24.13,23.88 21.8,26.2 | 21.8,26.2 21.55,26.46 20.32,26.46 20.15,26.28 v19.69,26.28 v18.54,25.14 | 14.29,24.64 14.29,24.89 C31.1 | 14.29,24.64 14.29,23.49 C30.2 14.46,23.11 13.48,24.09 12.05,24.09 11.76,23.8 | v16,24.64 14.29,24.64 | JP2.5 10.98,15.44 9.58,15.44 9,16.02 9,21.04 11.76,23.8 | v8.13,33.78 8.96,33.78 C3.1 | v8.13,35.81 9.08,35.81 C21.2 11.94,38.67 v11.94,38.86 | U4.3 U4.2 3.71,40.64 v3.71,41.91 | v4.06,49.78 4.57,50.29 R3.1 | v9.91,39.37 9.91,39.94 C1.2 | C7.1 27.43,63.31 v27.43,64.26 | U2.11 18.24,63.73 20.65,66.14 27.03,66.14 v27.43,66.55 28.45,67.56 R15.1 30.99,66.87 30.99,66.47 31.32,66.14 31.71,66.14 32.19,65.66 C24.2 33.21,64.26 v33.53,64.26
  Top 0.152: U3.3 U3.2 41.89,72.32 42.25,71.96 42.25,71.8 v42.67,71.37 | 45.15,64.01 v43.18,64.01 38.86,64.01 v37.59,65.28 | 45.15,64.01 45.4,64.01 C4.2 46.42,66.27 v46.69,66.54 | 45.15,64.01 44.52,63.38 C6.1 | v48.77,66.8 49.48,66.09 | v57.4,20.83 57.4,18.13 JST-LIPO.1 62.59,20.96 | 62.59,20.96 65.41,20.96 | JST-LIPO.SHLD2 60.76,11.94 63.97,11.94 66.29,14.26 66.29,16.26 66.04,16.51 65.28,16.51 | 62.59,20.96 64.01,22.37 66.04,22.37 66.17,22.51 66.17,23.56 66.04,23.69 65.97,23.69 v60.96,28.7 | v61.72,30.99 61.72,31.18 C26.2 | U5.2 U5.3 72.97,34.73 v73.15,34.54 | U5.2 72.1,35.93 72.1,35.36 71.88,35.14 v71.88,34.54 | v73.91,43.18 73.91,43.37 C9.2 70.8,46.48 v70.1,46.48 | v64.26,46.23 64.33,46.16 C12.1 | v56.64,46.74 56.64,44.38 R6.1 | 58.42,66.01 58.42,66.36 | C19.2 19.24,28.51 v19.3,28.45 | 53.59,66.36 54.24,65.71 54.24,65.1 54.64,64.69 S.4 | 59.22,57.44 58.93,57.44 | 58.93,57.44 58.69,57.44 58.64,57.49 58.41,57.49 U1.5 | U1.2 58.71,57.66 58.93,57.44
  Bottom 0.152: v3.05,29.97 3.81,30.73 v5.59,30.73 8.13,33.27 v8.13,33.78 v8.13,35.81 8.13,37.49 v3.71,41.91 3.71,49.43 v4.06,49.78 | v59.44,55.12 59.44,55.83 v60.45,56.84 | v65.02,20.57 65.02,18.54 v65.28,18.29 | v46.48,17.27 52.07,17.27 v52.58,16.76 | v38.1,8.13 37.85,8.13 v35.81,6.1 30.13,6.1 v29.62,6.6 | v39.62,9.4 41.4,9.4 v41.91,8.89 | v29.21,8.79 v29.21,18.54 22.35,18.54 PICO-D4.EXP 24.13,21.84 v24.13,23.88 | v18.54,25.14 16.5,25.14 v16,24.64 | v11.94,38.86 11.43,39.37 v9.91,39.37 | v27.43,64.26 v27.43,66.55 | v42.67,71.37 43.18,70.87 v43.18,64.01 | v46.69,66.54 46.95,66.8 v48.77,66.8 | v37.59,65.28 34.54,65.28 v33.53,64.26 | v57.4,20.83 54.36,20.83 v54.1,20.57 | v60.96,28.7 60.96,30.23 v61.72,30.99 65.28,34.54 v71.88,34.54 | v73.15,34.54 73.15,42.42 v73.91,43.18 | v70.1,46.48 64.52,46.48 v64.26,46.23 60.2,46.23 v58.67,47.75 57.66,47.75 v56.64,46.74 | v19.3,28.45 19.3,26.67 v19.69,26.28
  pour Bottom: 37.59,81.53 62.99,81.53 94.23,50.29 94.23,27.94 52.32,-13.97 34.8,-13.97 -20.83,41.66 19.05,81.53
  pour Top: 19.05,82.8 64.26,82.8 109.73,37.34 109.73,35.81 49.78,-24.13 40.13,-24.13 -25.65,41.66 15.49,82.8
GPIO0
  Top 0.152: Q1.6 22.3,12.19 22.3,14.02 23.83,15.55 23.83,15.85 PICO-D4.23
GPIO25
  Top 0.152: C23.2 31.07,71.53 30.99,71.48 29.62,71.48 26.87,68.73 26.87,68.58 25.45,67.16 20.42,67.16 13.01,59.74 13.01,59.28 14.38,57.91 15.44,57.91 15.9,58.37 U2.6 16.05,58.37 16.82,57.61 U2.7
GPIO26
  Top 0.152: C25.2 66.8,32.46 69.24,32.46 71.22,30.48 72.9,30.48 73.05,30.33 73.05,27.13 59.18,13.26 58.42,13.26 54.91,16.76 54.91,22.25 55.52,22.86 55.52,42.67 55.22,42.98 55.22,47.4 45.62,57 24.44,57 20.47,60.96 U2.8 20.32,61.11 19.56,61.87 U2.9
GPIO27  (via drill 0.35)
  Top 0.152: v35.41,17.68 35.41,12.8 33.27,10.67 32.21,10.67 31.45,9.91 31.45,8.38 31.75,8.08 31.75,5.94 32.66,5.03 32.66,4.42 C28.2 | v14.68,62.33 14.68,64.16 15.9,65.38 U2.13 15.9,65.53 15.14,66.29 U2.14
  Bottom 0.152: v35.41,17.68 35.41,18.14 14.68,38.86 v14.68,62.33
GPIO33
  Top 0.152: C22.2 13.77,49.53 13.77,57.61 12.24,59.13 12.24,61.72 12.4,61.87 U2.2 12.4,62.03 11.63,62.79 U2.1
IN+
  Top 0.152: R13.1 44.55,70.26 45.62,69.19 47.3,69.19 47.6,68.88 47.6,61.87 44.25,58.52 40.59,58.52 X1.2
IN+1
  Top 0.152: R1.1 17.42,44.65 17.42,43.28 20.02,40.69 X2.2
IN+2
  Top 0.152: R4.1 65.28,40.54 61.77,40.54 57.66,36.42 X3.2
IN+3
  Top 0.152: R7.1 30.68,14.33 37.08,20.73 X4.2
IN-
  Top 0.152: R14.1 30.68,70.1 30.68,69.49 32.05,68.12 32.05,67.67 R15.2 32.21,67.51 34.65,67.51 36.93,65.23 36.93,58.52 X1.1
IN-1
  Top 0.152: R3.2 7.37,50.29 7.37,47.55 10.41,44.5 R2.1 10.57,44.5 11.63,45.57 13.16,45.57 20.02,38.71 20.02,37.19 X2.1
IN-2
  Top 0.152: X3.1 57.66,39.93 58.27,40.54 58.27,44.2 R6.2 58.42,44.2 63.45,49.23 65.28,49.23 R5.1
IN-3
  Top 0.152: 40.74,7.47 34.19,7.47 32.51,9.14 R9.2 | 40.74,7.47 44.25,7.47 R8.1 | 40.74,7.47 40.74,20.73 X4.1
LNA_IN
  Top 0.152: PICO-D4.2 18.19,21.64 17.88,21.64 17.58,21.95 17.58,26.37 C31.2 17.73,26.52 18.8,27.58 26.42,27.58 29.31,24.69 C17.2
N$1  (via drill 0.35)
  Top 0.152: C2.1 2.64,44.2 1.58,43.13 1.58,39.62 4.17,37.03 4.17,36.27 U4.8 4.32,36.12 5.39,36.12 v5.54,35.97 | R1.2 19.25,44.65 21.39,42.52 21.39,36.42 20.63,35.66 17.42,35.66 14.83,33.07 11.63,33.07 C3.2 11.48,33.07 9.8,34.75 v6.76,34.75
  Bottom 0.152: v6.76,34.75 v5.54,35.97
N$2
  Top 0.152: 41.96,69.8 43.94,67.82 C5.1 44.55,67.82 45.62,68.88 47.14,68.88 47.3,68.73 47.3,64.06 46.53,63.3 46.53,62.48 C6.2 | 41.96,69.8 40.13,71.63 36.93,71.63 U3.8 | 41.96,69.8 43.64,71.48 45.31,71.48 46.38,70.41 R13.2
N$3
  Top 0.152: 44.55,65.99 46.38,67.82 C5.2 | R14.2 33.27,70.1 37.39,65.99 44.55,65.99 | C4.1 44.52,65.95 44.55,65.99
N$5
  Top 0.152: 4.32,41.15 4.32,44.04 4.47,44.2 C2.2 | 4.32,41.15 4.32,40.69 U4.1 4.32,41.15 | R2.2 12.24,44.35 9.35,41.45 9.35,41.15 C1.1 4.32,41.15
N$7
  Top 0.152: C11.2 60.4,49.84 64.06,49.84 64.52,50.29 66.19,50.29 66.34,50.14 66.34,46.18 67.11,45.42 67.11,40.69 R4.2 67.26,40.69 71.53,40.69 U5.8 71.68,40.69 71.68,41.15 72.14,41.61 73.81,41.61 74.12,41.3 74.12,39.78 73.97,39.62 73.81,39.62 71.07,36.88 71.07,32.61 C10.1
N$8
  Top 0.152: R5.2 67.26,49.23 67.26,48.16 70.61,44.81 C9.1 70.76,44.65 71.83,43.59 72.29,43.59 74.42,41.45 74.42,34.14 72.9,32.61 C10.2
N$10
  Top 0.152: U6.8 41.2,5.18 42.88,5.18 43.94,6.25 45.01,6.25 45.16,6.4 45.16,11.74 46.08,12.65 C15.2 46.23,12.8 46.23,13.56 47.14,14.48 47.14,22.56 | 47.14,22.56 48.21,22.56 48.82,21.95 C14.1 | 47.14,22.56 36.93,22.56 29.62,15.24 29.62,13.41 29.92,13.11 31.29,13.11 32.36,14.17 R7.2
N$11
  Top 0.152: 51.26,19.05 51.26,11.89 46.84,7.47 46.23,7.47 R8.2 | 51.26,19.05 50.8,19.51 50.8,21.79 C14.2 | 51.26,19.05 C13.1
N$13  (via drill 0.35)
  Top 0.152: v58.12,58.98 57.96,59.13 57.96,61.56 S.2 | v55.52,56.39 55.52,43.13 55.98,42.67 55.98,16.92 57.2,15.7 JST-LIPO.2
  Bottom 0.152: v55.52,56.39 v58.12,58.98
N$14
  Top 0.152: R11.1 10.87,28.65 11.94,27.58 13.31,27.58 16.36,30.63 16.36,34.14 17.58,35.36 20.78,35.36 21.69,36.27 21.69,49.23 20.63,50.29 R10.2 20.47,50.29 18.34,48.16 13.01,48.16 12.09,49.07 12.09,49.53 C22.1
N$16  (via drill 0.35)
  Top 0.152: R11.2 12.55,28.8 9.35,32 8.59,32 6.15,34.44 6.15,35.05 8.59,37.49 8.89,37.49 C21.1 9.04,37.64 10.11,38.71 10.41,38.71 13.61,41.91 v15.9,41.91 | v15.9,50.6 15.9,55.93 12.7,59.13 12.7,59.89 13.31,60.5 13.31,61.11 U2.3
  Bottom 0.152: v15.9,41.91 v15.9,50.6
N$17
  Top 0.152: R16.2 32.05,62.79 32.05,63.55 30.38,65.23 C24.1 30.23,65.23 22,65.23 18.34,61.57 17.88,61.57 15.75,59.44 15.29,59.44 U2.5
N$18
  Top 0.152: 33.43,73.76 33.43,72.09 32.51,71.17 29.77,71.17 29.62,71.02 29.62,69.19 29.77,69.04 30.68,69.04 31.29,68.43 31.29,66.6 31.45,66.45 32.82,66.45 34.39,64.87 34.39,63.14 32.97,61.72 31.29,61.72 30.38,62.64 R16.1 | 33.43,73.76 33.27,73.91 31.6,73.91 30.68,73 C23.1 | 33.43,73.76 34.04,74.37 44.7,74.37 46.38,72.69 R12.2
N$20
  Top 0.152: R18.1 70.16,29.57 67.87,29.57 64.97,32.46 C25.1 64.97,32.61 66.19,33.83 66.19,37.34 R17.2
N$21
  Top 0.152: R20.1 30.53,11.58 27.53,8.59 27.53,5.96 29.42,4.32 C28.1 30.84,4.27 32.51,2.59 43.94,2.59 46.08,4.72 R19.2
N$22  (via drill 0.35)
  Top 0.152: R18.2 71.98,29.41 70.92,28.35 62.69,28.35 58.57,32.46 C26.1 58.57,32.61 61.93,35.97 v61.93,39.78 | v54.61,47.09 54.61,47.4 45.77,56.24 24.74,56.24 21.39,59.59 16.36,59.59 14.99,58.22 14.53,58.22 13.92,58.83 13.92,58.98 15.44,60.5 15.9,60.5 18.19,62.79 18.64,62.79 U2.10
  Bottom 0.152: v61.93,39.78 59.64,42.06 57.35,42.06 54.61,44.81 v54.61,47.09
N$23  (via drill 0.35)
  Top 0.152: 35.41,18.59 36.32,19.51 37.85,19.51 39.22,20.88 39.22,21.34 40.13,22.25 41.2,22.25 44.25,19.2 44.25,15.24 C27.1 | 35.41,18.59 34.8,17.98 34.8,14.78 32.51,12.5 32.51,11.74 R20.2 | v15.29,63.09 16.82,64.62 U2.12 | 35.41,18.59 v35.87,18.59
  Bottom 0.152: v15.29,63.09 15.29,39.17 v35.87,18.59
N$26  (via drill 0.35)
  Top 0.152: PICO-D4.10 18.34,17.53 18.34,17.07 PICO-D4.11 18.19,17.07 17.88,17.07 17.58,16.76 17.58,16.31 v18.03,15.85 | v23.67,11.13 25.5,11.13 27.03,12.65 R21.2
  Bottom 0.152: v18.03,15.85 18.95,15.85 v23.67,11.13
RESET  (via drill 0.35)
  Top 0.152: 17.58,18.29 12.85,23.01 C30.1 | 17.58,18.29 17.73,18.14 18.19,18.14 PICO-D4.9 | 24.44,10.36 27.48,10.36 29.92,12.8 31.29,12.8 31.45,12.65 31.45,10.82 30.84,10.21 29.77,10.21 28.6,9.04 28.6,5.64 29.09,5.15 R22.1 | 24.44,10.36 23.52,10.36 Q1.3 | v17.27,17.98 17.58,18.29 | 24.44,10.36 v24.44,10.52
  Bottom 0.152: v17.27,17.98 17.73,17.98 24.44,11.28 v24.44,10.52
RTS  (via drill 0.35)
  Top 0.152: Q1.4 23.37,12.04 23.37,11.74 22.91,11.28 22.91,10.36 Q1.2 22.76,10.21 22.76,9.91 20.78,7.93 v20.47,7.93
  Bottom 0.152: v20.47,7.93 19.25,9.14 17.27,9.14 JP2.2
RXD  (via drill 0.35)
  Top 0.152: v21.39,23.62 22,24.23 22.61,24.23 22.91,23.93 22.91,22.71 PICO-D4.40
  Bottom 0.152: v21.39,23.62 14.53,16.76 14.53,13.87 13.61,12.95 JP2.4
TXD  (via drill 0.35)
  Top 0.152: v22.3,23.62 22.3,22.71 PICO-D4.41
  Bottom 0.152: v22.3,23.62 17.27,18.59 16.97,18.59 16.36,17.98 16.36,12.04 15.44,11.13 JP2.3
VBATT  (via drill 0.35)  (1 unrouted)
  Top 0.152: 54.86,58.98 56.13,58.98 56.57,58.55 U1.1 | 54.86,58.98 52.93,58.98 50.95,60.96 C32.1 | 54.86,58.98 53.62,60.23 53.62,61.8 50.9,64.52 v48.77,64.52 | S.3 56.59,61.78 56.59,61.43 56.74,61.27 56.74,60.15 56.84,60.15 57.51,59.48 57.51,58.73 57.86,58.37 58.04,58.37 U1.6
VCC  (via drill 0.35)
  Top 0.152: R22.2 36.17,6.86 38.61,4.42 41.05,4.42 U6.7 41.2,4.42 41.35,4.57 v43.03,4.57 | v47.14,8.69 46.23,9.6 46.23,9.91 C16.2 | 2.49,32.77 1.88,33.38 1.88,37.03 2.03,37.19 3.25,37.19 3.56,36.88 3.56,36.27 U4.7 | 2.49,32.77 6.76,28.5 C8.2 6.91,28.35 9.35,28.35 10.41,27.28 14.83,27.28 14.99,27.43 16.97,27.43 | 2.49,32.77 C29.1 | 27.18,21.34 25.96,22.56 24.44,22.56 PICO-D4.37 24.28,22.56 24.28,22.25 23.98,21.95 21.08,21.95 | 27.18,17.98 25.35,16.15 25.35,12.8 R21.1 | 27.18,21.34 27.18,17.98 | 27.18,21.34 C18.1 | 18.95,21.95 19.56,21.95 19.86,22.25 | 18.95,21.95 18.34,21.95 PICO-D4.1 | 19.86,22.25 19.86,22.56 PICO-D4.46 | 21.08,21.95 21.23,22.1 21.23,22.56 PICO-D4.43 | 21.08,21.95 20.17,21.95 19.86,22.25 | 18.34,20.88 18.34,21.03 PICO-D4.3 18.19,21.03 17.88,21.03 16.82,22.1 16.82,27.28 16.97,27.43 | 18.34,20.88 18.34,20.57 PICO-D4.4 | 18.34,20.88 18.49,20.73 | 18.49,20.73 18.95,20.27 18.95,17.07 19.25,16.76 21.39,16.76 21.84,16.31 21.84,16 PICO-D4.19 21.84,15.85 21.84,15.7 21.39,15.24 17.73,15.24 16.66,16.31 10.11,16.31 JP2.6 | 16.97,27.43 17.27,27.74 17.27,33.22 C19.1 | 18.95,21.95 18.95,21.18 18.49,20.73 | v30.53,17.07 28.09,17.07 27.18,17.98 | 56.29,56.54 56.59,56.24 57.35,56.24 | 56.29,56.54 55.22,57.61 55.22,58.06 46.23,58.06 v45.47,58.83 | 57.35,56.24 62.23,56.24 C20.1 | 66.34,41.76 66.34,44.35 C12.2 | 66.34,41.76 66.34,39.78 66.5,39.62 71.98,39.62 72.29,39.93 72.29,40.54 U5.7 | 57.35,56.24 57.35,41.61 56.29,40.54 56.29,39.32 57.05,38.56 | 57.05,38.56 59.33,38.56 62.54,41.76 66.34,41.76 | v35.87,68.43 35.87,71.93 36.17,72.24 36.78,72.24 U3.7 | v34.34,66.9 34.85,66.4 34.85,60.45 C7.2
  Top 0.152: v29.01,65.84 20.78,65.84 17.42,62.48 16.97,62.48 14.83,60.35 14.38,60.35 U2.4 | v56.59,19.05 56.59,25.76 56.29,26.06 56.29,37.8 57.05,38.56 | 56.29,56.54 56.29,56.87 U1.3
  Bottom 0.152: v30.53,17.07 v43.03,4.57 v47.14,8.69 47.14,9.6 v56.59,19.05 | v29.01,65.84 33.27,65.84 v34.34,66.9 v35.87,68.43 v45.47,58.83
VOUT1
  Top 0.152: U4.5 2.34,36.27 2.95,36.27 U4.6 3.1,36.12 3.1,35.36 3.25,35.2 5.69,35.2 6.15,35.66 6.15,36.27 3.86,38.56 3.1,38.56 1.88,39.78 1.88,41.45 3.56,43.13 3.56,44.96 6.3,47.7 6.3,51.05 6.6,51.36 11.94,51.36 13.01,50.29 13.01,48.62 13.16,48.46 14.68,48.46 16.51,50.29 R10.1
VOUT2
  Top 0.152: U3.6 36.93,73 36.93,73.61 U3.5 36.93,73.76 37.24,74.07 42.11,74.07 43.48,72.69 44.4,72.69 R12.1
VOUT3
  Top 0.152: U5.5 73.51,40.69 73.05,40.69 U5.6 72.9,40.54 72.9,39.78 72.44,39.32 66.34,39.32 64.36,37.34 R17.1
VOUT4
  Top 0.152: U6.5 41.05,3.2 41.05,3.66 U6.6 41.2,3.81 43.33,3.81 44.25,4.72 R19.1